# EAGLE design TEMT6000 (EAGLE 6.5.0)
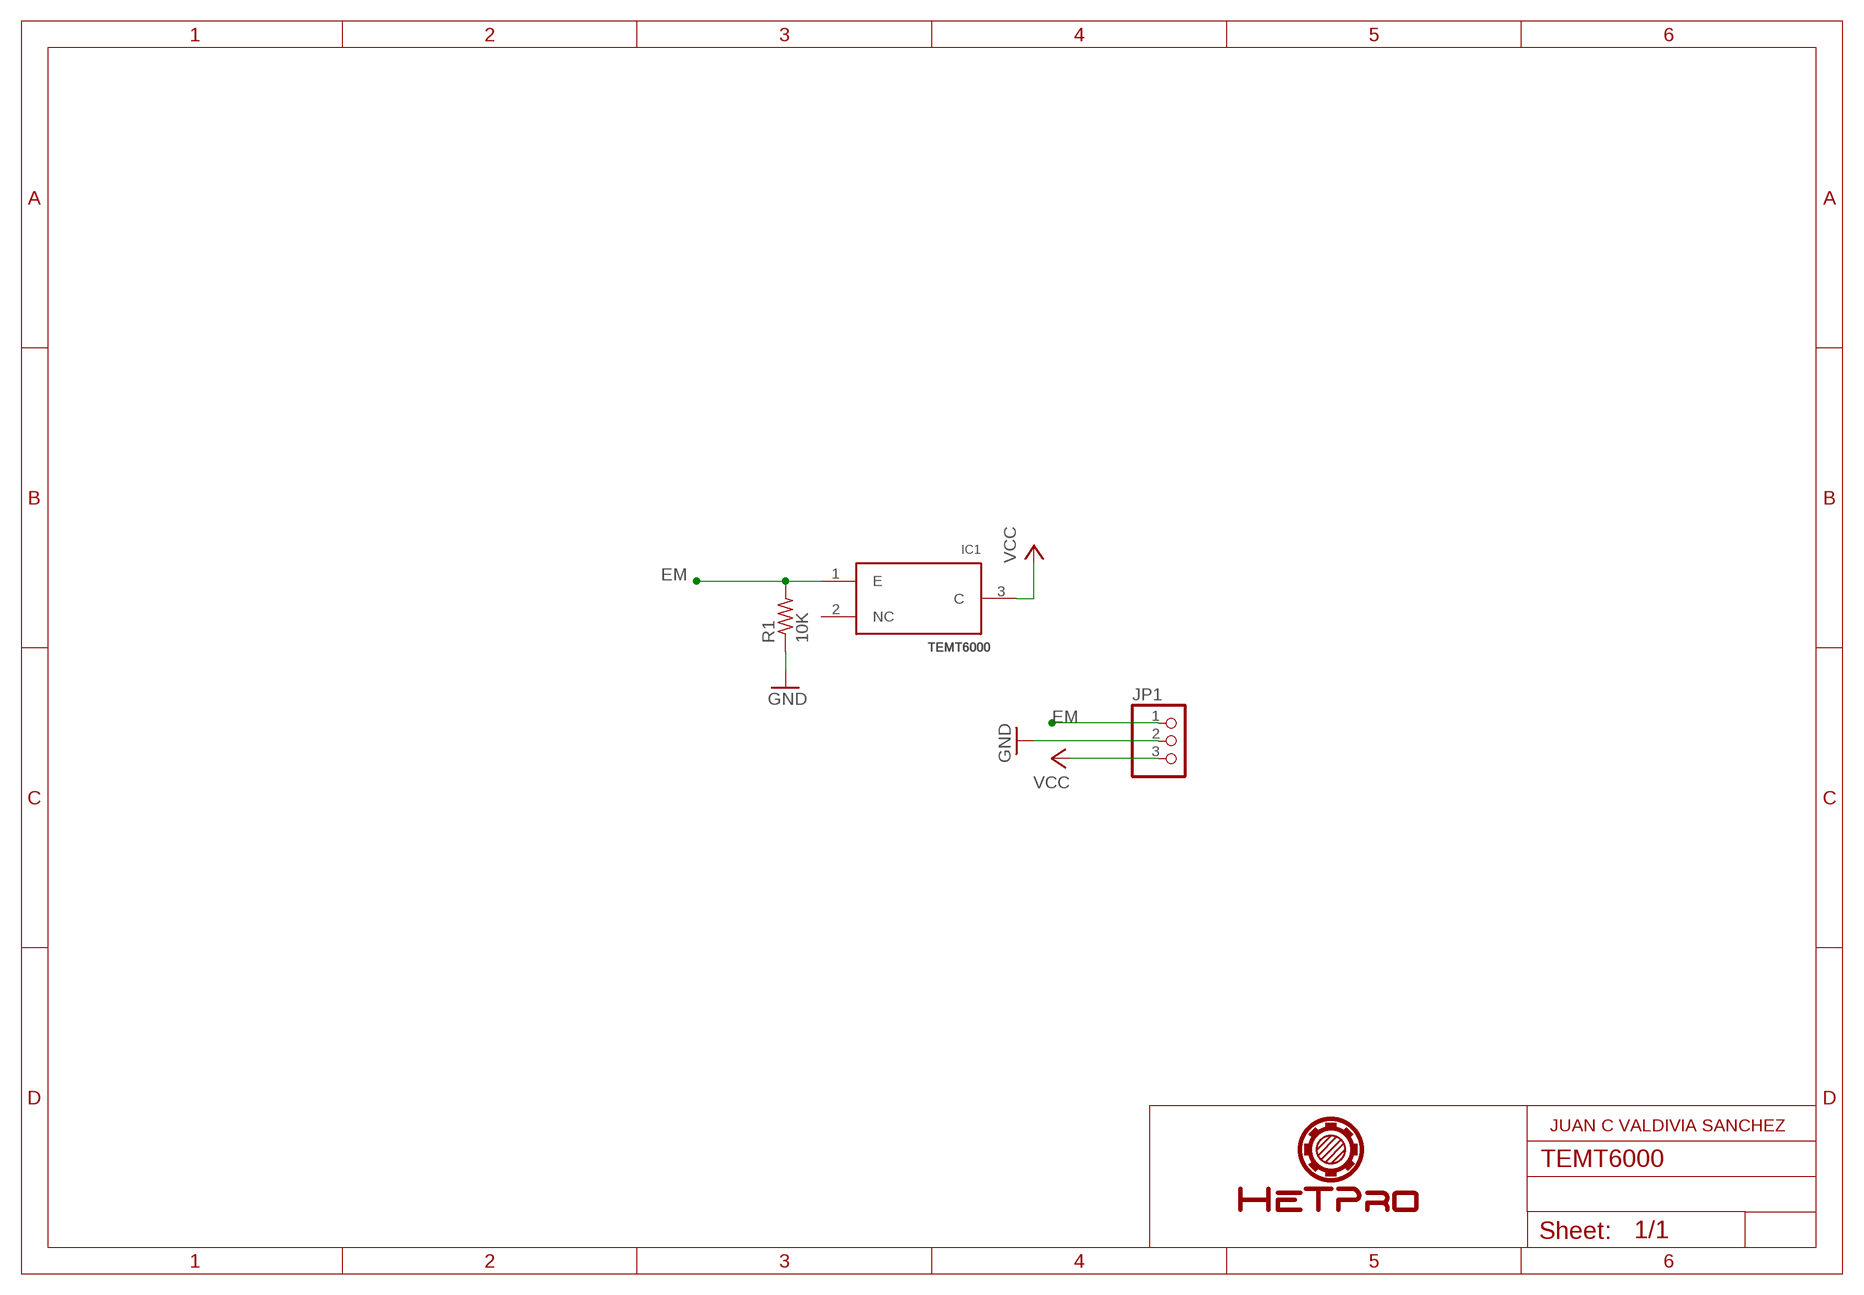
[diagram p0: schematic, sheet 1]

## Parts
IC1  TEMT6000  [TEMT6000]
JP1  PINHD-1X3  [1X03]
R1  10K  R-US_R0603  [R0603]

## Nets
EM: IC1.1(E) JP1.1 R1.2
GND: JP1.2 R1.1
VCC: IC1.3(C) JP1.3
Unconnected: IC1.2(NC)

## Notes on the sheet
- JUAN C VALDIVIA SANCHEZ

## Library data of the parts
IC1 = TEMT6000:TEMT6000
JP1 = pinhead:PINHD-1X3: PIN HEADER
R1 = resistor:R-US_: RESISTOR, American symbol

## Board
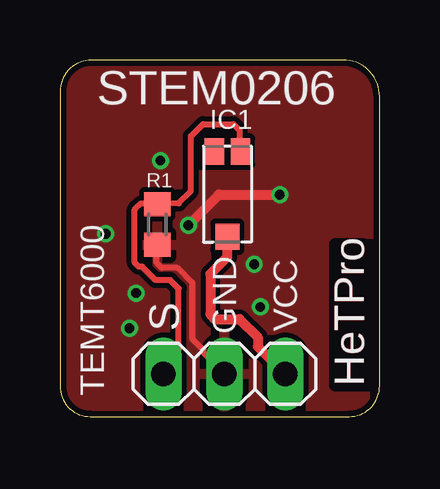
[diagram p1: board, top side]
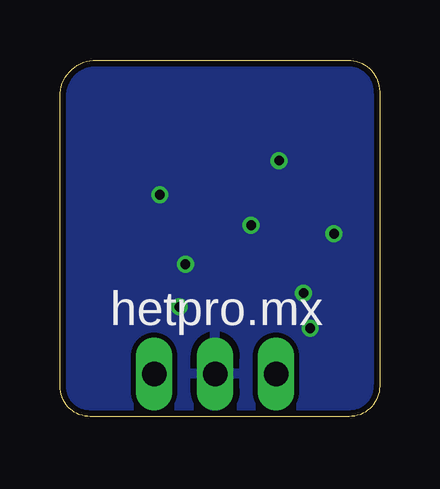
[diagram p2: board, bottom side, seen from below]

Size 13.34 x 14.86 mm. Coordinates in mm from the lower left corner, seen from the top.
Outline: 13.34,1.27 13.34,13.34 arc90 11.81,14.86 1.33,14.86 arc90 0,13.53 0,1.27 arc90 1.27,0 12.06,0 arc90 13.34,1.27
Copper layers (1*16): Top 0.035mm / dielectric 1.5mm / Bottom 0.035mm
Design rules "DRC_HeTPpro_08_2014": minimum track width 8mil, minimum drill 12mil, track to track 8mil, track to pad 8mil, pad to pad 8mil, via to via 8mil, smd to smd 0mil, copper to edge 10mil, drill to drill 10mil, minimum pad ring 10mil, minimum via ring 6mil, stop-mask expansion 2mil, vias tented up to drill 100mil, thermal gap 10mil

### Footprints (pad centres in the part's own frame; a part is rotated, then mirrored left to right if it is on the bottom)
TEMT6000 = smd 1.1 x 0.8: 1 -1.775,0.55; 2 -1.775,-0.55 | smd 1.1 x 1: 3 1.775,0
1X03 = drill 1.016 long: 1 -2.54,0; 2 0,0; 3 2.54,0
R0603 = smd 1 x 1.1: 1 -0.85,0; 2 0.85,0

### Placement (x,y rotation side)
IC1  6.99,9.27 270 top
JP1  6.86,1.78 0 top
R1  4.06,8 90 top

### Tracks (layer width: path | path; a pad name or v marks a point on that pad's centre or on a via)
EM
  Top 0.254: IC1.1 7.49,11.09 7.49,11.94 7.24,12.19 5.97,12.19 5.46,11.68 5.46,9.4 4.95,8.89 R1.2 4.03,8.89 3.38,8.89 3.12,8.64 3.12,6.4 3.28,6.25 3.43,6.25 3.99,5.69 4.6,5.69 4.95,5.33 4.95,2.79 4.52,2.36 4.32,2.36 JP1.1
GND  (via drill 0.4)
  Top 0.254: R1.1 4.04,7.13 4.04,6.4 4.24,6.2 4.9,6.2 5.51,5.59 5.51,3.25 5.97,2.79 5.97,2.67 JP1.2
  Top 0.406: v5.36,7.98 6.63,9.25 v9.17,9.25
  other vias: 4.19,10.67 1.91,7.62 3.17,5.15 2.9,3.68 8.1,6.35 8.36,4.57
  pour Bottom: 0,1.27 0,13.53 arc-90 1.33,14.86 11.81,14.86 arc-90 13.34,13.34 13.34,1.27 arc-90 12.06,0 1.27,0 arc-90
  pour Top: 0,1.27 0,13.53 arc-90 1.33,14.86 11.81,14.86 arc-90 13.34,13.34 13.34,1.27 arc-90 12.06,0 1.27,0 arc-90
VCC
  Top 0.406: IC1.3 6.99,6.66 6.27,5.94 6.27,4.27 6.48,4.06 7.49,4.06 8.26,3.3 8.26,2.92 JP1.3

### Text on the board
Top: HeTPro
tPlace: STEM0206 | S | VCC | GND | TEMT6000 | HeTPro
bPlace: hetpro.mx
205bmp: www.hetpro.com.mx